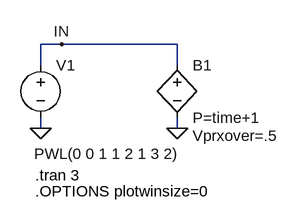
[diagram p0: schematic Fig_2-67_BP-TEST.asc]
Fig_2-67_BP-TEST.asc, the LTspice schematic file:
Version 4
SHEET 1 880 680
WIRE 80 80 48 80
WIRE 256 80 80 80
WIRE 48 112 48 80
WIRE 256 112 256 80
WIRE 48 208 48 192
WIRE 256 208 256 192
FLAG 48 208 0
FLAG 256 208 0
FLAG 80 80 IN
SYMBOL bv 256 96 R0
WINDOW 123 24 124 Left 2
SYMATTR InstName B1
SYMATTR Value P=time+1
SYMATTR Value2 Vprxover=.5
SYMBOL voltage 48 96 R0
WINDOW 3 -10 151 Left 2
WINDOW 123 0 0 Left 0
WINDOW 39 0 0 Left 0
SYMATTR InstName V1
SYMATTR Value PWL(0 0 1 1 2 1 3 2)
TEXT 40 280 Left 2 !.tran 3
TEXT 40 304 Left 2 !.OPTIONS plotwinsize=0

The netlist it stands for:
* Fig_2-67_BP-TEST.asc
B1 IN 0 P=time+1 Vprxover=.5
V1 IN 0 PWL(0 0 1 1 2 1 3 2)
.tran 3
.OPTIONS plotwinsize=0
.backanno
.end